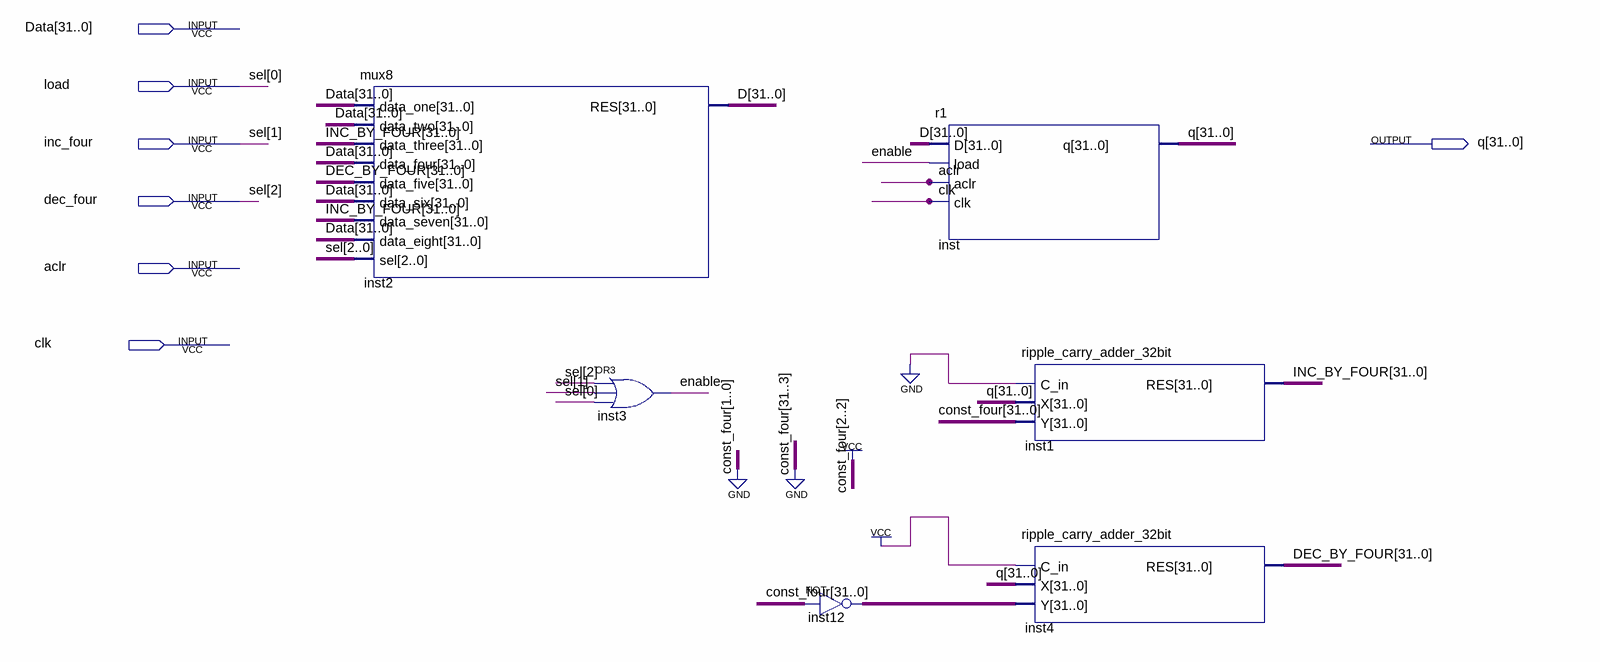
[diagram p0: schematic sheet]
// Quartus schematic r3.bdf as structural Verilog: 6 symbols, 7 pins
module r3 (
  input  [31:0] Data,
  input  load,
  input  inc_four,
  input  dec_four,
  input  aclr,
  input  clk,
  output [31:0] q
);

  wire enable;
  wire [31:0] D, DEC_BY_FOUR, INC_BY_FOUR, inst12_out;

  mux8 inst2 (
    .data_one(Data), .data_two(Data), .data_three(INC_BY_FOUR), .data_four(Data), .data_five(DEC_BY_FOUR),
    .data_six(Data), .data_seven(INC_BY_FOUR), .data_eight(Data), .sel({dec_four, inc_four, load}), .RES(D));
  or inst3 (enable, dec_four, inc_four, load);
  assign inst12_out = ~32'b00000000000000000000000000000100;  // NOT inst12, 32 bits wide
  r1 inst (.D(D), .load(enable), .aclr(aclr), .clk(clk), .q(q));
  ripple_carry_adder_32bit inst1 (.C_in(1'b0), .X(q), .Y(32'b00000000000000000000000000000100), .RES(INC_BY_FOUR));
  ripple_carry_adder_32bit inst4 (.C_in(1'b1), .X(q), .Y(inst12_out), .RES(DEC_BY_FOUR));

  // Other names for the same wires on the sheet: sel[2:0] = {dec_four, inc_four, load}
endmodule
